# Altium schematic sheet RGB Identifier for intelligent instruction label.SchDoc
size A4
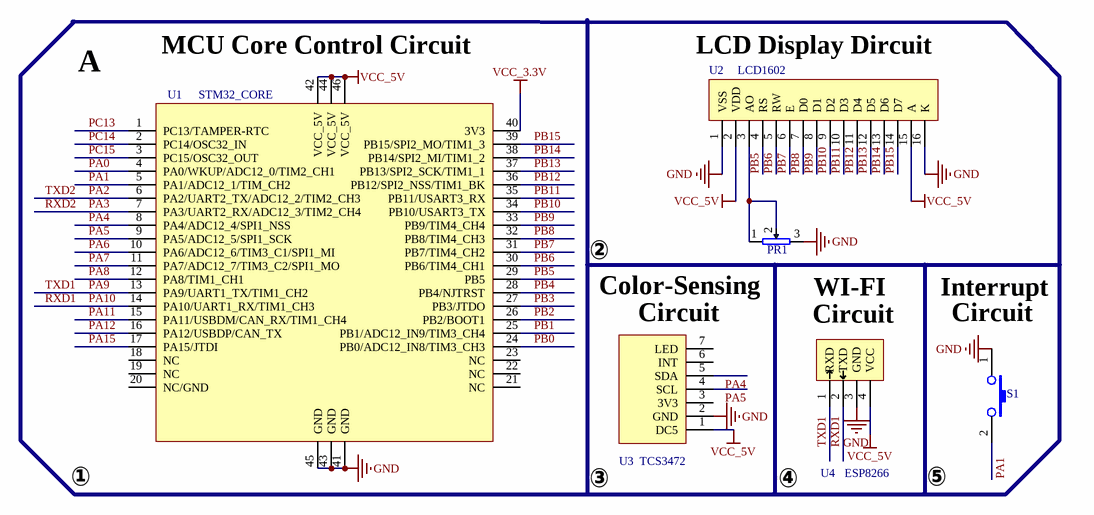
[diagram p0: RGB Identifier for intelligent instruction label.SchDoc]

## Parts
PR1  103  [WH06-2]  (value not drawn)
S1  Button  [BUTTON_6x6DIP]  (value not drawn)
U1  STM32_CORE  [STM32_CORE]
U2  LCD1602  [LCD1602]
U3  TCS3472  [TCS3472_MODE]
U4  ESP8266  [蓝牙MODE竖放]

## Nets
GND: PR1.3 S1.1 U1.41(GND) U1.43(GND) U1.45(GND) U2.1(VSS) U2.16(K) U3.2(GND) U4.3(GND)
VCC_3.3V: U1.40(3V3)
VCC_5V: U1.42(VCC_5V) U1.44(VCC_5V) U1.46(VCC_5V) U2.2(VDD) U2.15(A) U3.1(DC5) U4.4(VCC)
PA0: U1.4(PA0/WKUP/ADC12_0/TIM2_CH1)
PA1: S1.2 U1.5(PA1/ADC12_1/TIM_CH2)
PA2: U1.6(PA2/UART2_TX/ADC12_2/TIM2_CH3)  [also labelled TXD2]
PA3: U1.7(PA3/UART2_RX/ADC12_3/TIM2_CH4)  [also labelled RXD2]
PA4: U1.8(PA4/ADC12_4/SPI1_NSS) U3.5(SDA)
PA5: U1.9(PA5/ADC12_5/SPI1_SCK) U3.4(SCL)
PA6: U1.10(PA6/ADC12_6/TIM3_C1/SPI1_MI)
PA7: U1.11(PA7/ADC12_7/TIM3_C2/SPI1_MO)
PA8: U1.12(PA8/TIM1_CH1)
PA9: U1.13(PA9/UART1_TX/TIM1_CH2) U4.1(RXD)  [also labelled TXD1]
PA10: U1.14(PA10/UART1_RX/TIM1_CH3) U4.2(TXD)  [also labelled RXD1]
PA11: U1.15(PA11/USBDM/CAN_RX/TIM1_CH4)
PA12: U1.16(PA12/USBDP/CAN_TX)
PA15: U1.17(PA15/JTDI)
PB0: U1.24(PB0/ADC12_IN8/TIM3_CH3)
PB1: U1.25(PB1/ADC12_IN9/TIM3_CH4)
PB2: U1.26(PB2/BOOT1)
PB3: U1.27(PB3/JTDO)
PB4: U1.28(PB4/NJTRST)
PB5: U1.29(PB5) U2.4(RS)
PB6: U1.30(PB6/TIM4_CH1) U2.5(RW)
PB7: U1.31(PB7/TIM4_CH2) U2.6(E)
PB8: U1.32(PB8/TIM4_CH3) U2.7(D0)
PB9: U1.33(PB9/TIM4_CH4) U2.8(D1)
PB10: U1.34(PB10/USART3_TX) U2.9(D2)
PB11: U1.35(PB11/USART3_RX) U2.10(D3)
PB12: U1.36(PB12/SPI2_NSS/TIM1_BK) U2.11(D4)
PB13: U1.37(PB13/SPI2_SCK/TIM1_1) U2.12(D5)
PB14: U1.38(PB14/SPI2_MI/TIM1_2) U2.13(D6)
PB15: U1.39(PB15/SPI2_MO/TIM1_3) U2.14(D7)
PC13: U1.1(PC13/TAMPER-RTC)
PC14: U1.2(PC14/OSC32_IN)
PC15: U1.3(PC15/OSC32_OUT)
NetPR1_1: PR1.1 PR1.2 U2.3(AO)

Not connected (* = marked no-connect by the designer): U1 18(NC) 19(NC) 20(NC/GND) 21(NC) 22(NC) 23(NC); U3 3(3V3) 6(INT) 7(LED)

## Notes on the sheet
- A
- (near U1) MCU Core Control Circuit
- LCD Display Dircuit
- ②
- Color-Sensing
- (near U3) Circuit
- Circuit
- (near PR1) WI-FI
- Interrupt
- (near S1) Circuit
- ①
- ③
- ④
- ⑤

## Library data of the parts
PR1 = PR: 电位器
S1 = Button: 按键
U1 = STM32_CORE: STM32核心板
U2 = LCD1602: LCD1602液晶
U4 = 蓝牙MODE: 蓝牙模块